# Altium schematic sheet SwitchingSection.SchDoc: IN, SWITCH,OUT
size 420 x 297 mm; Revision: 1.0; SheetNumber: 3
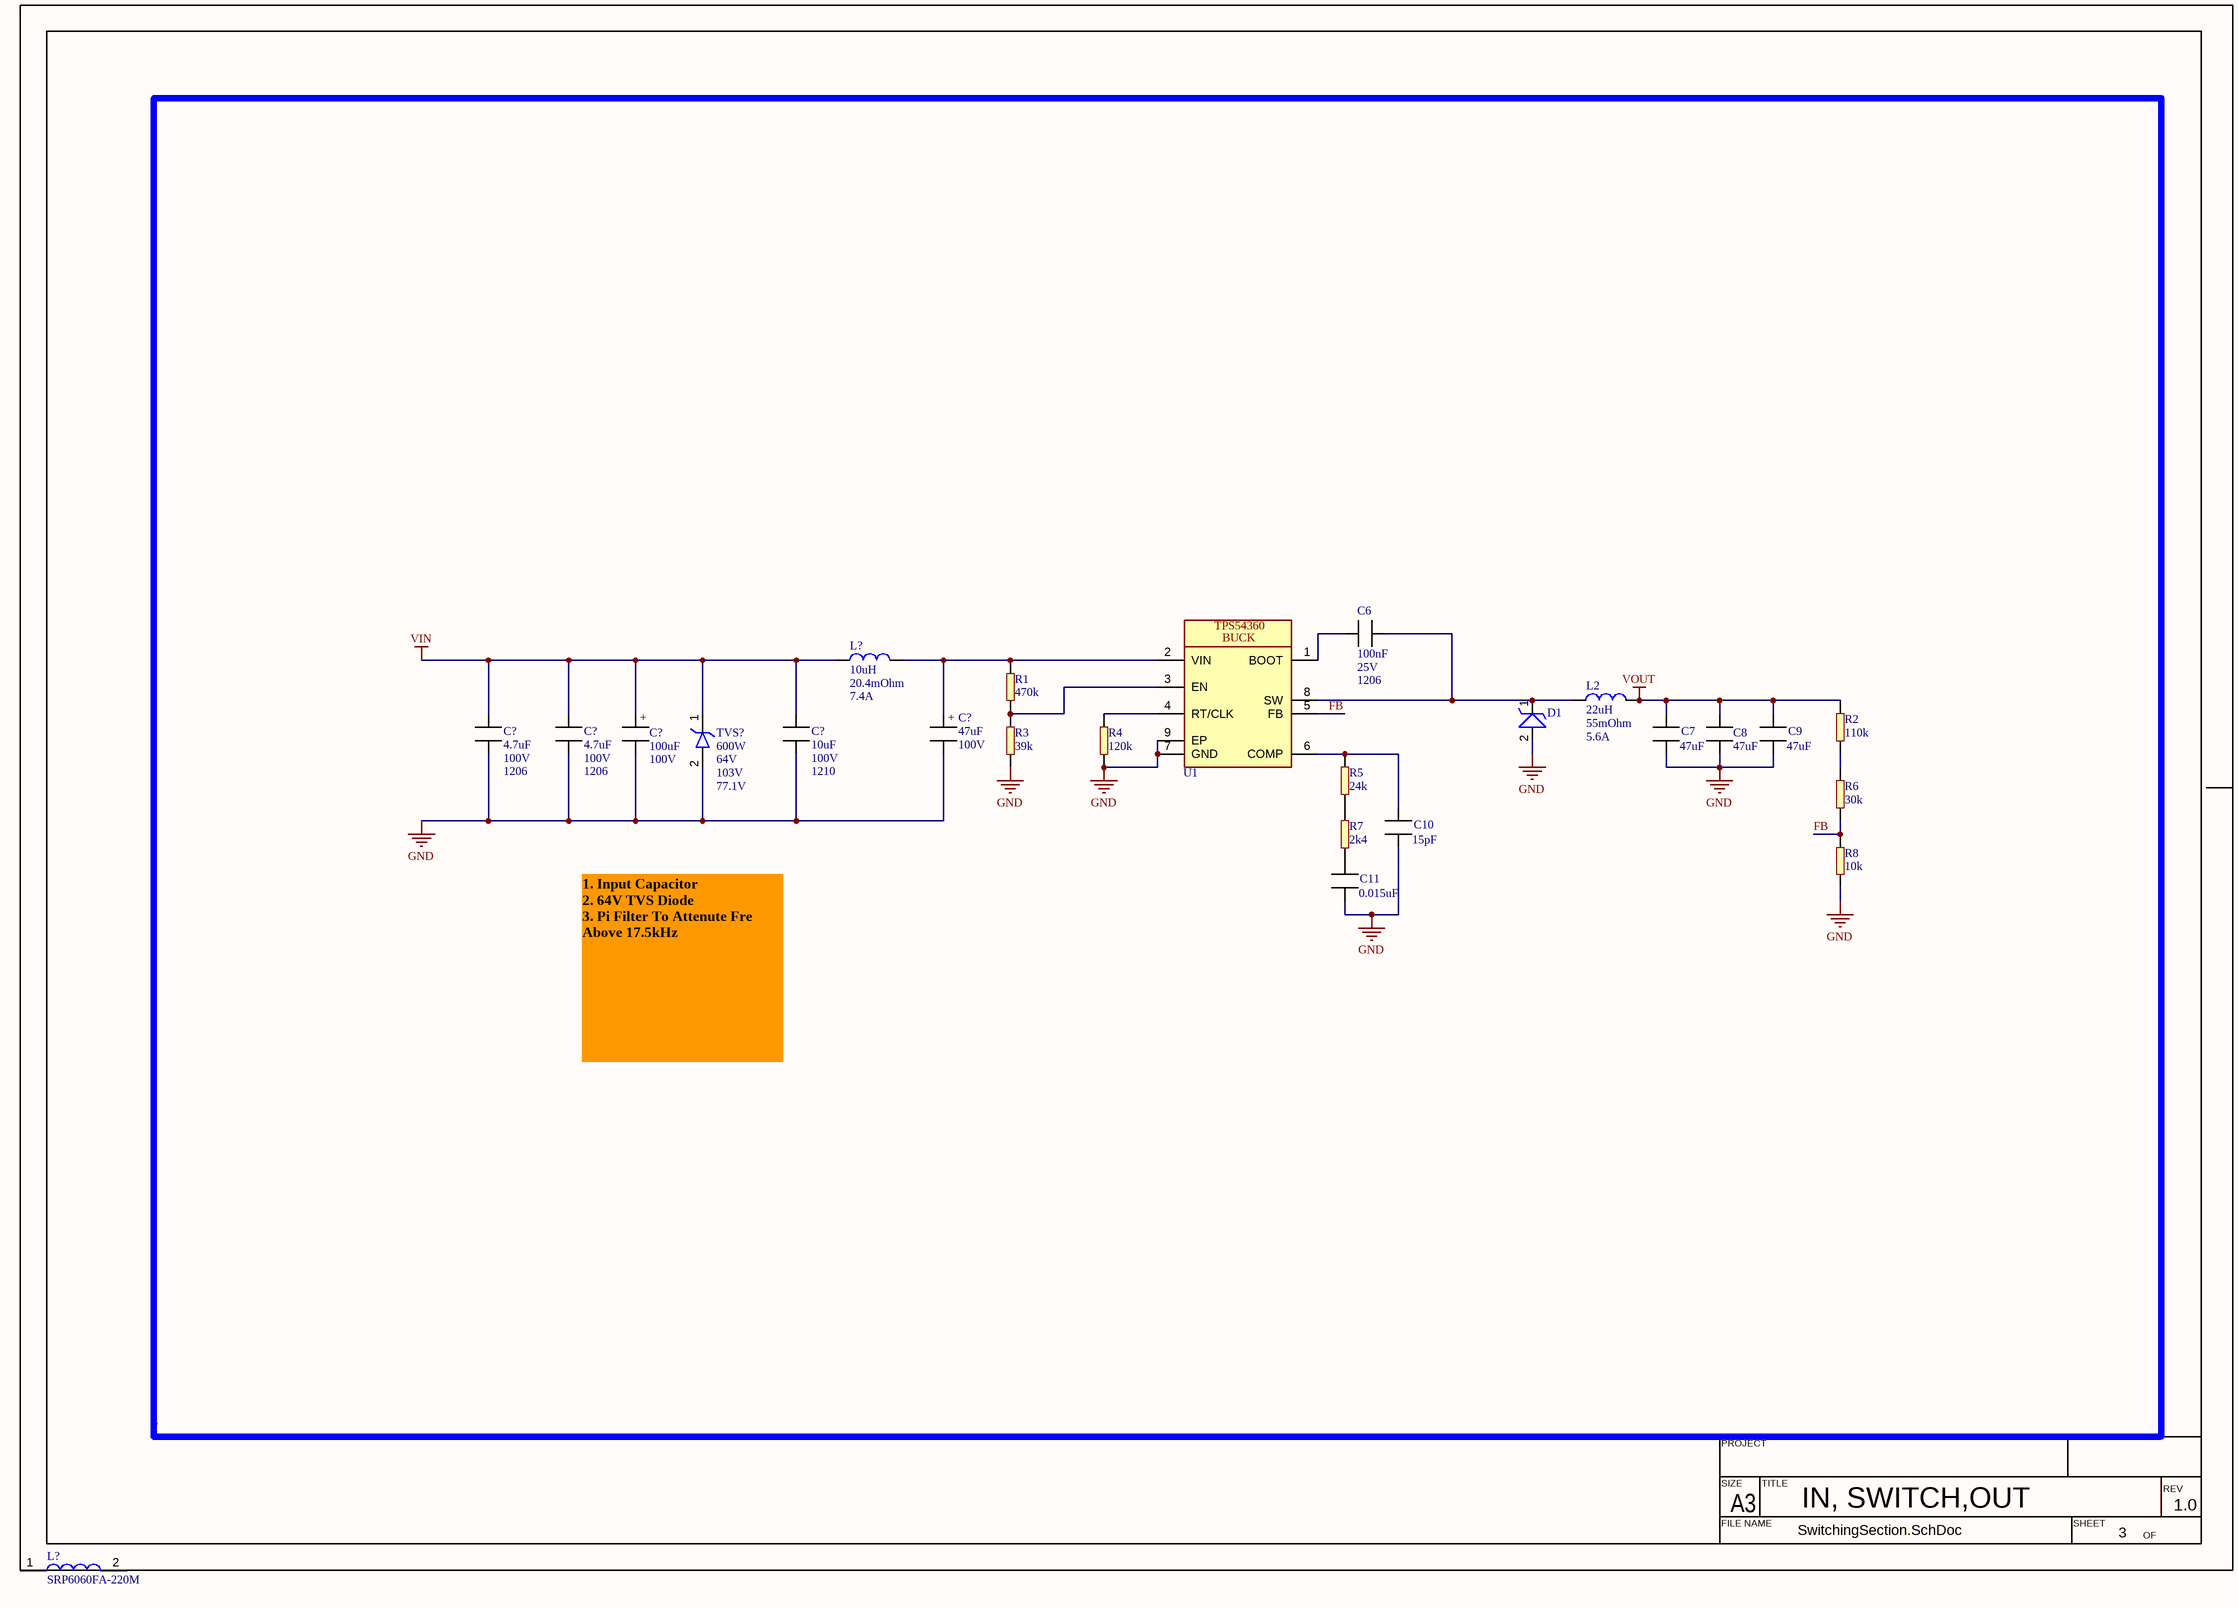
[diagram p0: SwitchingSection.SchDoc]

## Parts
(Parts that share a designator on the sheet are numbered #1, #2 ... from top to bottom, then left to right.)
C6  value 100nF  Voltage: 25V  Package: 1206  [CAP1206]  (hidden comment: MLCC_1206)
C7  value 47uF  [CAPC1608X10N]  (hidden comment: ERP_102-1)
C8  value 47uF  [CAPC1608X10N]  (hidden comment: ERP_102-1)
C9  value 47uF  [CAPC1608X10N]  (hidden comment: ERP_102-1)
C10  value 15pF  [CAPC1608X10N]  (hidden comment: ERP_102-1)
C11  value 0.015uF  [CAPC1608X10N]  (hidden comment: ERP_102-1)
C?#1  value 4.7uF  Voltage: 100V  Package: 1206  [CAP1206]  (hidden comment: MLCC_1206)
C?#2  value 4.7uF  Voltage: 100V  Package: 1206  [CAP1206]  (hidden comment: MLCC_1206)
C?#3  value 100uF  Voltage: 100V  [CAP_12P5_13P5]  (hidden comment: CAP_12P5_13P5)
C?#4  value 10uF  Voltage: 100V  Package: 1210  [CAP1210]  (hidden comment: MLCC_1210)
C?#5  value 47uF  Voltage: 100V  [UUX_XXXXX_NL]  (hidden comment: UUX_XXXXX)
D1  CDBB_5XX_HF  [SMB(DO214AA)]  (value not drawn)
L2  value 22uH  DCR: 55mOhm  ISAT: 5.6A  [SRP6060FA]  (hidden comment: SRP6060FA)
L?#1  value 10uH  DCR: 20.4mOhm  ISAT: 7.4A  [XGL6060]  (hidden comment: XGL6060)
L?#2  SRP6060FA-220M  [SRP6060FA220M]
R1  value 470k  [RES_0603]  (hidden comment: ERP_101-1)
R2  value 110k  [RES_0603]  (hidden comment: ERP_101-1)
R3  value 39k  [RES_0603]  (hidden comment: ERP_101-1)
R4  value 120k  [RES_0603]  (hidden comment: ERP_101-1)
R5  value 24k  [RES_0603]  (hidden comment: ERP_101-1)
R6  value 30k  [RES_0603]  (hidden comment: ERP_101-1)
R7  value 2k4  [RES_0603]  (hidden comment: ERP_101-1)
R8  value 10k  [RES_0603]  (hidden comment: ERP_101-1)
TVS?  PD: 600W  VRV: 64V  VCL: 103V  VBR: 77.1V  [SMBJ58A]  (hidden comment: SMBJ58A)
U1  TPS54360DDAR  [TPS54360DDAR]  (value not drawn)

## Nets
GND: C7.2 C8.2 C9.2 C10.2 C11.2 C?#1.2 C?#2.2 C?#3.2 C?#4.2 C?#5.2 D1.2(A) R3.1 R4.1 R8.1 TVS?.2(A) U1.7(GND) U1.9(EP)
VIN: C?#1.1 C?#2.1 C?#3.1 C?#4.1 L?#1.1 TVS?.1(K)
VOUT: C7.1 C8.1 C9.1 L2.2 R2.2
FB: R6.1 R8.2 U1.5(FB)
NetC6_1: C6.1 U1.1(BOOT)
NetC6_2: C6.2 D1.1(K) L2.1 U1.8(SW)
NetC10_1: C10.1 R5.2 U1.6(COMP)
NetC11_1: C11.1 R7.1
NetC?#5_1: C?#5.1 L?#1.2 R1.2 U1.2(VIN)
NetR1_1: R1.1 R3.2 U1.3(EN)
NetR2_1: R2.1 R6.2
NetR4_2: R4.2 U1.4(RT/CLK)
NetR5_1: R5.1 R7.2

Not connected (* = marked no-connect by the designer): L?#2 1 2

## Notes on the sheet
- 1. Input Capacitor
  2. 64V TVS Diode
  3. Pi Filter To Attenute Fre Above 17.5kHz
- PROJECT
- SIZE
- FILE NAME
- A3
- TITLE
- SHEET
- OF
- REV
- (in symbol CAP_12P5_13P5) +
- (in symbol TPS54360DDAR) TPS54360; BUCK
- (in symbol UUX_XXXXX) +

## Library data of the parts
C6 = MLCC_1206: MLCC 1206 (3216 Metric); Manufacturer 1: *; Manufacturer Part Number 1: *
C7-C11 = MLCC_0603: Chip Capacitor, 2-Leads, Body 1.60x0.80mm, IPC Medium Density; Package: 0603; Manufacturer 1: *; Manufacturer Part Number 1: *
C?#1 C?#2 = MLCC_1206: MLCC 1206 (3216 Metric); Manufacturer 1: Murata Electronics; Manufacturer Part Number 1: GRM31CZ72A475KE11L
C?#3 = CAP_12P5_13P5: SMD,D12.5xL13.5mm  Aluminum Electrolytic Capacitors - SMD ROHS; Manufacturer 1: NCC(Nippon Chemi-Con); Manufacturer Part Number 1: EMVY101ARA101MKE0S; Package: 12.5X13.5
C?#4 = MLCC_1210: MLCC 1210 (3225 Metric); Manufacturer 1: *; Manufacturer Part Number 1: *
C?#5 = UUX_XXXXX: Nichicon UUX Series; Manufacturer Part Number 1: UUX2A470MNL1GS; Package: NL; Manufacturer 1: Nichicon
D1 = CDBB_5XX_HF: SMB(DO-214AA) DIODE HF 5A; Manufacturer Part Number 1: CDBB5100-HF; Manufacturer 1: Comchip; Package: SMB; Value: *
L2 = SRP6060FA: SRP6060FA Bourns 6.4 x 6.6 MM; Manufacturer Part Number 1: SRP6060FA-220M; Manufacturer 1: Coilcraft
L?#1 = XGL6060: Manufacturer Part Number 1: XGL6060-103MEC; Manufacturer 1: Coilcraft
L?#2 = SRP6060FA-220M: Inductor; Manufacturer_Name: Bourns; Datasheet Link: https://www.bourns.com/docs/Product-Datasheets/SRP6060FA.pdf; Height: 6mm; Manufacturer_Part_Number: SRP6060FA-220M; Mouser Part Number: 652-SRP6060FA-220M; Mouser Price/Stock: https://www.mouser.co.uk/ProductDetail/Bourns/SRP6060FA-220M?qs=MLItCLRbWszoNCUJzZhC7Q%3D%3D; Arrow Part Number: SRP6060FA-220M; Arrow Price/Stock: https://www.arrow.com/en/products/srp6060fa-220m/bourns?utm_currency=USD&region=nac
R1-R8 = RES_0603: Package: 0603; Manufacturer 1: *; Manufacturer Part Number 1: *
TVS? = SMBJ58A: TVS DIODE DO-214AA, SMB; Manufacturer Part Number 1: SMBJ64A; Manufacturer 1: *; Value: *
U1 = TPS54360DDAR: Buck, Split Rail Switching Regulator IC Positive Adjustable 0.8V 1 Output 3.5A 8-PowerSOIC (0.154", 3.90mm Width); Manufacturer 1: Texas Instruments; Value: *; Manufacturer Part Number 1: TPS54360DDAR